# EAGLE design bluetooth_module (EAGLE 4.16)
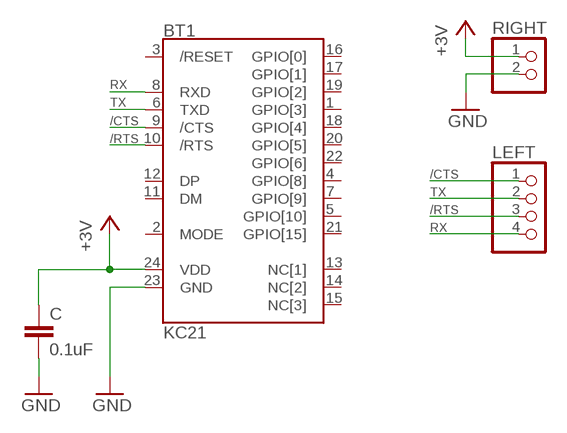
[diagram p0: schematic, sheet 1]

## Parts
BT1  KC21  [KC21]
C  0.1uF  C-EUC2012  [C2012]
LEFT  PINHD-1X4  [1X04]
RIGHT  PINHD-1X2  [1X02]

## Nets
+3V: BT1.24(VDD) C.1 RIGHT.1
/CTS: BT1.9(/CTS) LEFT.1
/RTS: BT1.10(/RTS) LEFT.3
GND: BT1.23(GND) C.2 RIGHT.2
RX: BT1.8(RXD) LEFT.4
TX: BT1.6(TXD) LEFT.2
Unconnected: BT1.1(GPIO[3]) BT1.2(MODE) BT1.3(/RESET) BT1.4(GPIO[8]) BT1.5(GPIO[10]) BT1.7(GPIO[9]) BT1.11(DM) BT1.12(DP) BT1.13(NC[1]) BT1.14(NC[2]) BT1.15(NC[3]) BT1.16(GPIO[0]) BT1.17(GPIO[1]) BT1.18(GPIO[4]) BT1.19(GPIO[2]) BT1.20(GPIO[5]) BT1.21(GPIO[15]) BT1.22(GPIO[6])

## Library data of the parts
BT1 = kcwirefree_bluetooth:KC21
C = rcl:C-EU: CAPACITOR, European symbol
LEFT = pinhead:PINHD-1X4: PIN HEADER
RIGHT = pinhead:PINHD-1X2: PIN HEADER

## Board
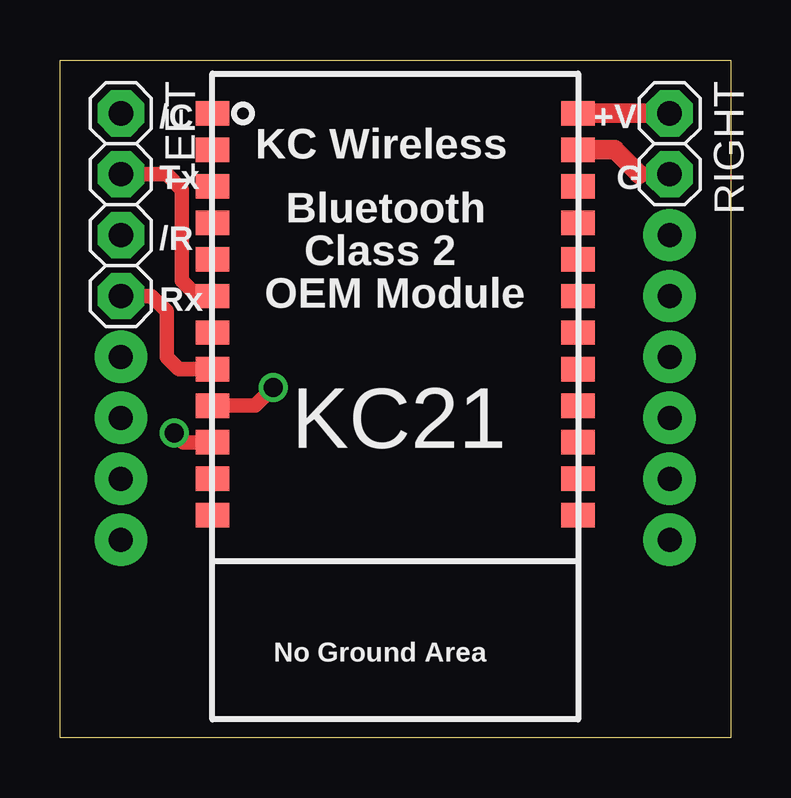
[diagram p1: board, top side]
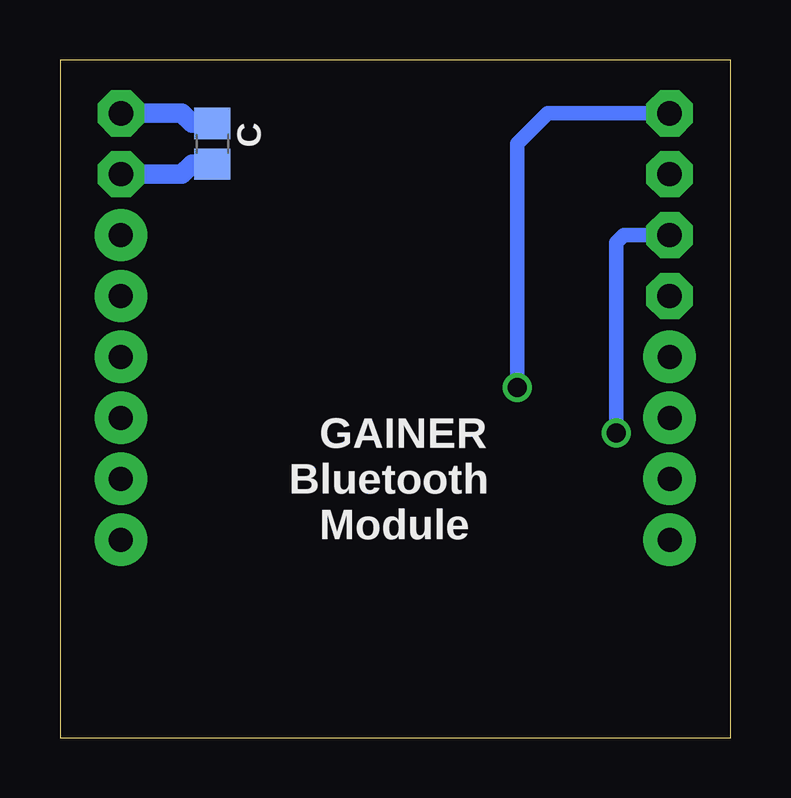
[diagram p2: board, bottom side, seen from below]

Size 27.94 x 28.26 mm. Coordinates in mm from the lower left corner, seen from the top.
Outline: 0,0 0,28.26 27.94,28.26 27.94,0 0,0
Copper layers (1*16): Top 0.035mm / dielectric 1.5mm / Bottom 0.035mm
Design rules "8mils": minimum track width 10mil, minimum drill 24mil, track to track 8mil, track to pad 8mil, pad to pad 8mil, via to via 8mil, smd to smd 8mil, copper to edge 40mil, drill to drill 10mil, minimum pad ring 10mil, minimum via ring 8mil, stop-mask expansion 0mil, vias tented up to drill 0mil, thermal gap 10mil

### Footprints (pad centres in the part's own frame; a part is rotated, then mirrored left to right if it is on the bottom)
KC21 = smd 1.397 x 1.016: 1 0,0; 2 0,-1.524; 3 0,-3.048; 4 0,-4.572; 5 0,-6.096; 6 0,-7.62; 7 0,-9.144; 8 0,-10.668; 9 0,-12.192; 10 0,-13.716; 11 0,-15.24; 12 0,-16.764; 13 15.24,-16.764; 14 15.24,-15.24; 15 15.24,-13.716; 16 15.24,-12.192; 17 15.24,-10.668; 18 15.24,-9.144; 19 15.24,-7.62; 20 15.24,-6.096; 21 15.24,-4.572; 22 15.24,-3.048; 23 15.24,-1.524; 24 15.24,0
C2012 = smd 1.3 x 1.5: 1 -0.85,0; 2 0.85,0
1X04 = drill 1.016 pad 1.93 octagon: 1 -3.81,0; 2 -1.27,0; 3 1.27,0; 4 3.81,0
1X02 = drill 1.016 pad 1.93 octagon: 1 -1.27,0; 2 1.27,0

### Placement (x,y rotation side)
BT1  6.35,26.04 0 top
C  21.59,24.77 270 bottom
LEFT  2.54,22.22 270 top
RIGHT  25.4,24.77 270 top

### Tracks (layer width: path | path; a pad name or v marks a point on that pad's centre or on a via)
+3V
  Top 0.813: RIGHT.1 BT1.24
  Bottom 0.813: C.1 22.44,25.61 22.86,26.04 RIGHT.1
/CTS  (via drill 0.8)
  Top 0.61: BT1.9 8.13,13.84 v8.89,14.61
  Bottom 0.61: v8.89,14.61 8.89,24.77 7.62,26.04 LEFT.1
/RTS  (via drill 0.8)
  Top 0.61: BT1.10 5.14,12.32 v4.76,12.7
  Bottom 0.61: v4.76,12.7 4.76,20.64 4.45,20.95 LEFT.3
GND
  Top 0.61: 24.13,23.5 RIGHT.2
  Top 0.813: BT1.23 23.11,24.51 24.13,23.5
  Bottom 0.813: C.2 22.44,23.91 22.86,23.5 RIGHT.2
N$1  (via drill 1 pad 2.18)
  other vias: 2.54,15.88
N$2  (via drill 1 pad 2.18)
  other vias: 2.54,13.34
N$3  (via drill 1 pad 2.18)
  other vias: 2.54,10.8
N$4  (via drill 1 pad 2.18)
  other vias: 2.54,8.25
N$5  (via drill 1 pad 2.18)
  other vias: 25.4,20.95
N$6  (via drill 1 pad 2.18)
  other vias: 25.4,18.41
N$7  (via drill 1 pad 2.18)
  other vias: 25.4,15.88
N$8  (via drill 1 pad 2.18)
  other vias: 25.4,13.34
N$9  (via drill 1 pad 2.18)
  other vias: 25.4,10.8
N$10  (via drill 1 pad 2.18)
  other vias: 25.4,8.25
RX
  Top 0.61: BT1.8 4.95,15.37 4.45,15.88 4.45,17.78 3.81,18.41 LEFT.4
TX
  Top 0.61: BT1.6 5.71,18.41 5.08,19.05 5.08,22.86 4.45,23.5 LEFT.2

### Text on the board
tNames: /C | +V | Tx | G | /R | Rx
bNames: GAINER | Bluetooth | Module